# EAGLE design Cutter_V1B (EAGLE 6.4)
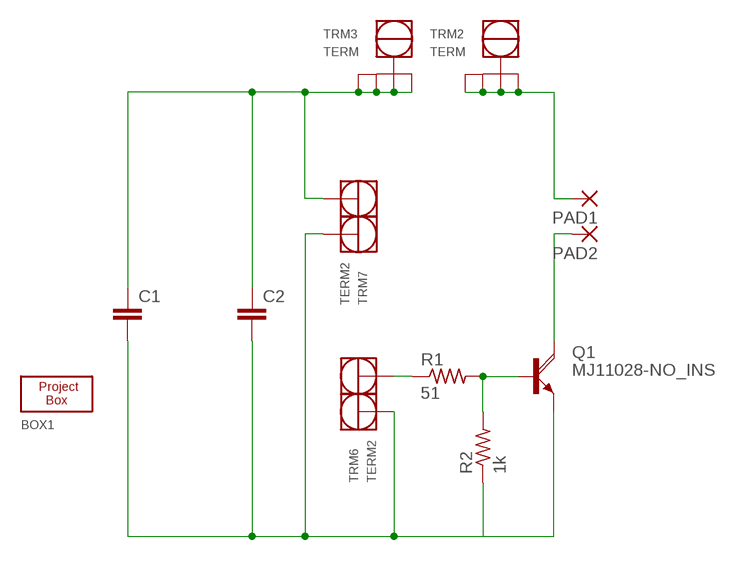
[diagram p0: schematic, sheet 1]

## Parts
BOX1  RS_BOX_3IN  [RS_BOX_OUTLINE_3IN]
C1  C1400X850  [SUPERCAP1.4/0.85H]
C2  C1400X850  [SUPERCAP1.4/0.85H]
PAD1  2,15/1,0  [2,15/1,0]
PAD2  2,15/1,0  [2,15/1,0]
Q1  MJ11028-NO_INS  [TO-3-NO_INSULATOR]
R1  51  R-US_0207/10  [0207/10]
R2  1k  R-US_0207/10  [0207/10]
TRM2  TERM  [SCREWTERM-300MILSQ]
TRM3  TERM  [SCREWTERM-300MILSQ]
TRM6  TERM2  [SCREWTERMBLK-DUAL]
TRM7  TERM2  [SCREWTERMBLK-DUAL]

## Nets
C: PAD2.1(P) Q1.C Q1.C1(C)
N$1: C1.P$2 C2.P$2 Q1.E R2.1 TRM6.P$1(P1) TRM7.P$1(P1)
N$2: C1.P$1 C2.P$1 TRM3.P$1(P1) TRM3.P$2(P2) TRM3.P$3(P3) TRM3.P$4(P4) TRM7.P$2(P2)
N$3: PAD1.1(P) TRM2.P$1(P1) TRM2.P$2(P2) TRM2.P$3(P3) TRM2.P$4(P4)
N$4: Q1.B R1.2 R2.2
N$5: R1.1 TRM6.P$2(P2)

## Library data of the parts
BOX1 = mymechanical:RS_BOX_3IN
C1 C2 = mypassives:C1400X850
PAD1 PAD2 = wirepad:2,15/1,0: THROUGH-HOLE PAD
Q1 = mypower:MJ11028-NO_INS
R1 R2 = resistor:R-US_: RESISTOR, American symbol
TRM2 TRM3 = mymechanical:TERM
TRM6 TRM7 = mymechanical:TERM2

## Board
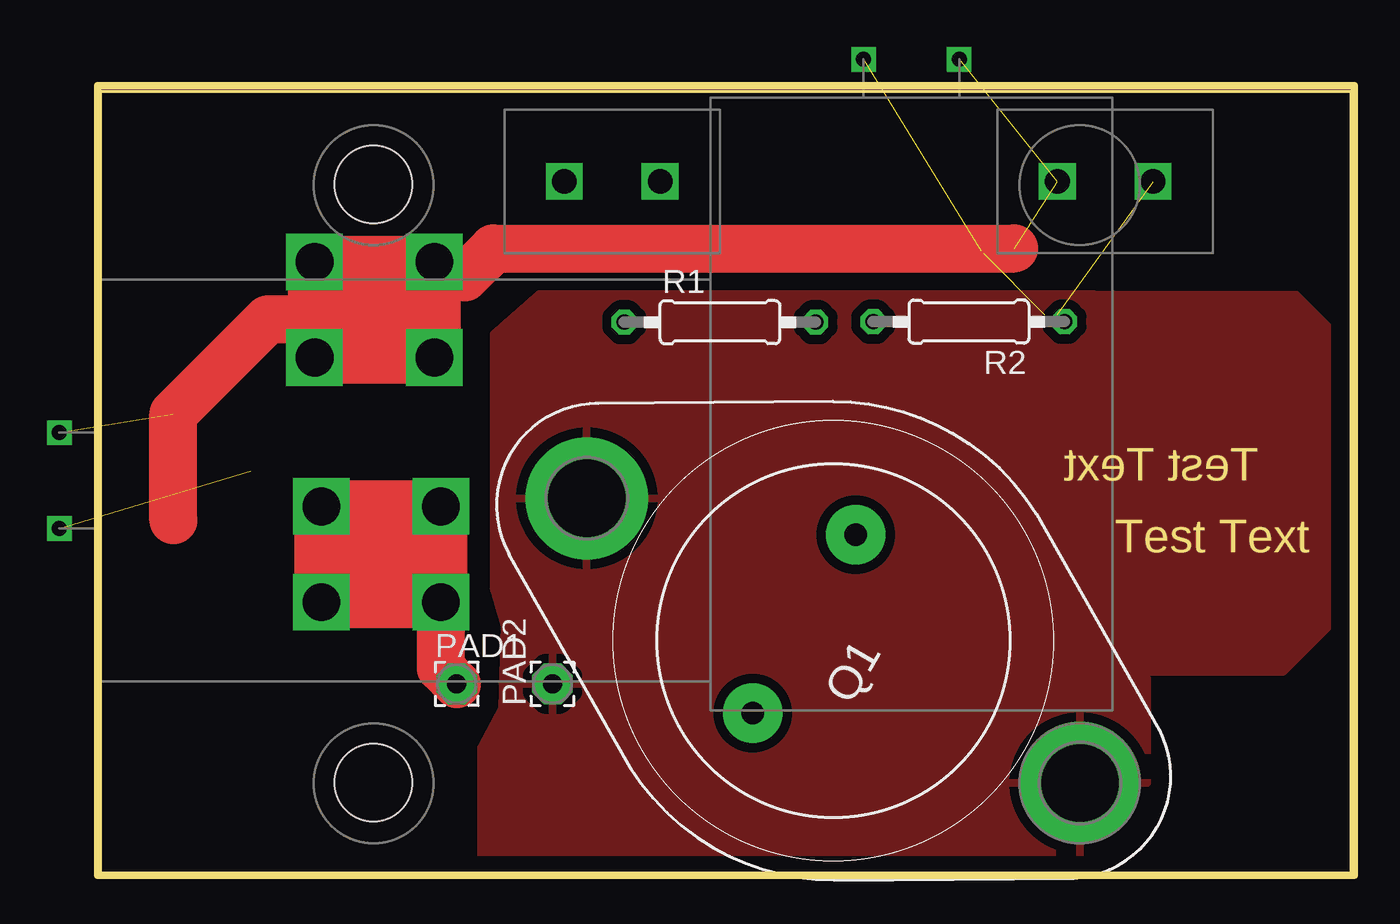
[diagram p1: board, top side]
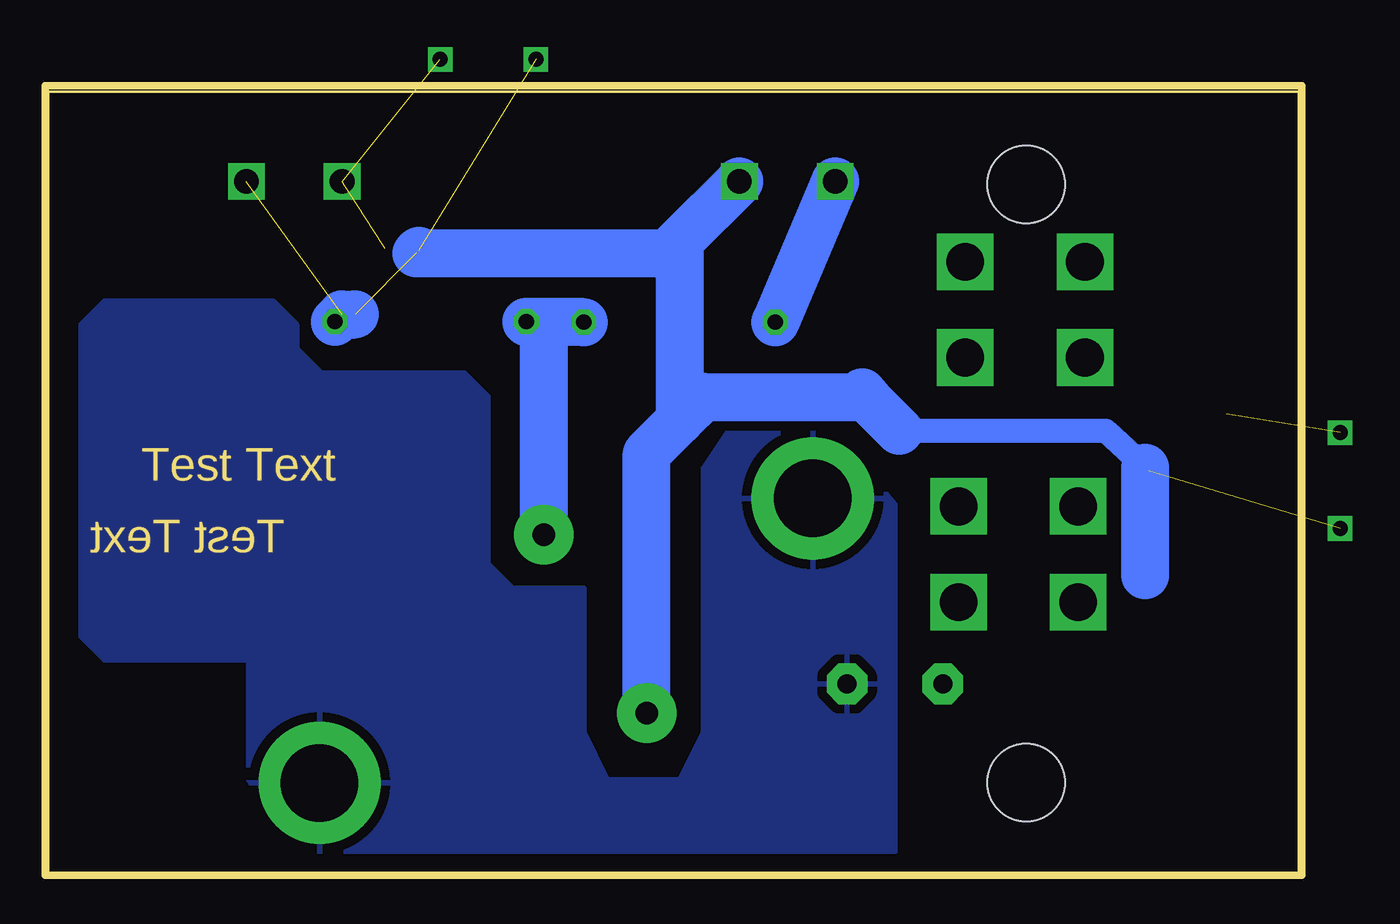
[diagram p2: board, bottom side, seen from below]

Size 66.47 x 41.65 mm. Coordinates in mm from the lower left corner, seen from the top.
Outline: 0,0 66.47,0 66.47,41.65 0,41.65 0,0
Copper layers (1*16): Top 0.035mm / dielectric 1.5mm / Bottom 0.035mm
Design rules "default *": minimum track width 10mil, minimum drill 24mil, track to track 20mil, track to pad 20mil, pad to pad 20mil, via to via 20mil, smd to smd 20mil, copper to edge 40mil, drill to drill 8mil, minimum pad ring 10mil, minimum via ring 8mil, stop-mask expansion 4mil, vias tented up to drill 0mil, thermal gap 20mil
Holes 4.11 mm at 14.63,4.93 14.63,36.68
Milling: 4 lines

### Footprints (pad centres in the part's own frame; a part is rotated, then mirrored left to right if it is on the bottom)
SUPERCAP1.4/0.85H = drill 0.8 square: P$1 -2.54,-18.542; P$2 2.54,-18.542
2,15/1,0 = drill 1.016 pad 2.159 octagon: 1 0,0
TO-3-NO_INSULATOR = drill 1.194 pad 3.15: B -1.778,5.461; E -1.778,-5.461 | drill 4.115 pad 6.477: C 15.113,0; C1 -15.113,0
0207/10 = drill 0.813 octagon: 1 -5.08,0; 2 5.08,0
SCREWTERM-300MILSQ = drill 2 square: P$1 -3.175,-2.54; P$2 -3.175,2.54; P$3 3.175,2.54; P$4 3.175,-2.54
SCREWTERMBLK-DUAL = drill 1.3 square: P$1 -2.54,0; P$2 2.54,0

### Placement (x,y rotation side)
BOX1  33.69,20.76 0 top
C1  16.51,20.95 270 top
C2  43.18,24.77 180 top
PAD1  19.05,10.16 0 top
PAD2  24.13,10.16 90 top
Q1  39.04,12.46 330 top
R1  33.02,29.36 0 top
R2  46.23,29.39 180 top
TRM2  15.04,17.04 0 top
TRM3  14.68,30.02 180 top
TRM6  27.3,36.83 180 top
TRM7  53.47,36.83 180 top

### Tracks (layer width: path | path; a pad name or v marks a point on that pad's centre or on a via)
C
  pour Top: 20.35,0.91 52.48,0.91 55.7,4.9 55.7,10.46 55.37,10.79 62.92,10.79 65.38,13.26 65.38,29.06 63.6,30.84 53.49,30.84 52.88,30.86 23.42,30.86 21.01,28.73 21.01,15.27 21.59,13.26 21.46,8.89 20.35,6.78
  pour Bottom (isolate 0.025, rank 6): 53.34,1.27 55.88,5.08 55.88,11.43 63.5,11.43 64.77,12.7 64.77,29.21 63.5,30.48 54.61,30.48 53.34,29.21 53.34,27.94 52.07,26.67 44.45,26.67 43.18,25.4 43.18,16.51 41.91,15.24 38.1,15.24 38.1,7.62 36.83,5.08 33.02,5.08 31.75,7.62 31.75,21.59 30.48,23.49 24.77,23.49 21.59,19.68 21.59,1.27
N$1  (4 unrouted)
  Bottom 1.27: 8.13,21.46 8.31,21.64 10.34,23.52 10.41,23.6 21.36,23.6
  Bottom 2.54: 8.31,15.93 8.31,21.64 | 21.36,23.6 22.86,25.09 23.32,25.63 23.56,25.4 31.75,25.4 33.02,24.13 | R2.1 50.93,29.77 50.24,29.77 | Q1.E 34.77,22.38 33.02,24.13 | TRM6.P$1 33.02,33.66 | 33.02,33.66 33.02,24.13 | 33.02,33.66 33.66,33.02 46.99,33.02 46.86,33.15
N$2  (3 unrouted)
  Top 0.305: TRM3.P$3 11.51,31.8 11.56,31.85 11.56,31.88 TRM3.P$4 11.51,29.69 11.68,29.52 | TRM3.P$2 TRM3.P$1 18.11,32.18 18.34,32.18 18.77,31.75 19.48,31.75
  Top 2.54: 19.48,31.75 21.01,33.27 48.64,33.27 | 4.01,18.85 4.01,24.49 9.04,29.52 11.68,29.52 14.1,31.93 TRM3.P$1
N$3
  Top 0.305: TRM2.P$2 12.01,20.07 12.01,19.81 11.86,19.66 TRM2.P$1 12.01,15.14 12.01,15.04 18.21,15.04 TRM2.P$4 TRM2.P$3
  Top 2.54: PAD1.1 18.21,11 TRM2.P$3
N$4
  Bottom 2.54: R1.2 41.12,29.36 arc90 R2.2 40.23,29.39 Q1.B
N$5
  Bottom 2.54: TRM6.P$2 R1.1

### Text on the board
Milling: Test Text | Test Text